# Altium schematic sheet Mechanical.SchDoc: Mechanical
size A4; ApprovedBy: LD Stanton; Author: LD Stanton; CompanyName: University of Cape Town; DrawnBy: Lawrence Stanton; Engineer: Lawrence Stanton; Organization: University of Cape Town; Address1: Department of Electrical Engineering; Address2: Rondebosch; Address3: Cape Town; Address4: South Africa 7701; DocumentNumber: 17; SheetNumber: 17; SheetTotal: 20
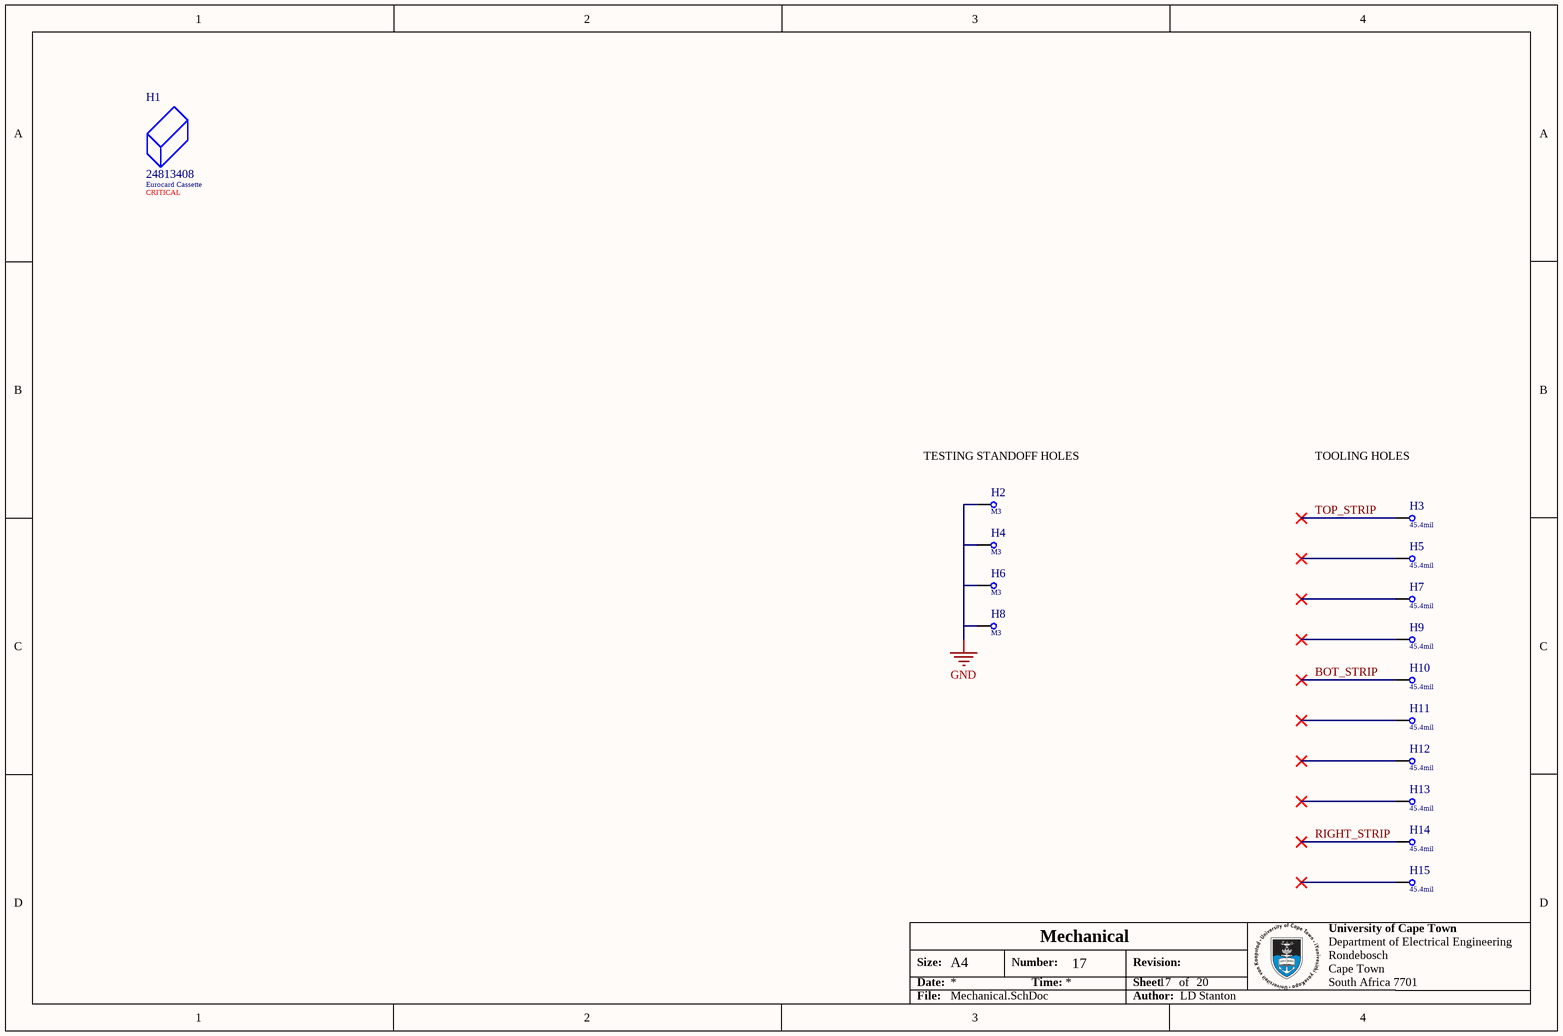
[diagram p0: Mechanical.SchDoc]

## Parts
H1  24813408  Type: Eurocard Cassette  Placement: CRITICAL  (mechanical)
H2  Size: M3  [Mounting Hole M3 Plated Tight Via]  (hidden comment: Mounting Hole M3)  (no BOM)
H3  Size: 45.4mil  [Tooling Hole JLCPCB]  (hidden comment: Tooling Hole JLCPCB)  (no BOM)
H4  Size: M3  [Mounting Hole M3 Plated Tight Via]  (hidden comment: Mounting Hole M3)  (no BOM)
H5  Size: 45.4mil  [Tooling Hole JLCPCB]  (hidden comment: Tooling Hole JLCPCB)  (no BOM)
H6  Size: M3  [Mounting Hole M3 Plated Tight Via]  (hidden comment: Mounting Hole M3)  (no BOM)
H7  Size: 45.4mil  [Tooling Hole JLCPCB]  (hidden comment: Tooling Hole JLCPCB)  (no BOM)
H8  Size: M3  [Mounting Hole M3 Plated Tight Via]  (hidden comment: Mounting Hole M3)  (no BOM)
H9  Size: 45.4mil  [Tooling Hole JLCPCB]  (hidden comment: Tooling Hole JLCPCB)  (no BOM)
H10  Size: 45.4mil  [Tooling Hole JLCPCB]  (hidden comment: Tooling Hole JLCPCB)  (no BOM)
H11  Size: 45.4mil  [Tooling Hole JLCPCB]  (hidden comment: Tooling Hole JLCPCB)  (no BOM)
H12  Size: 45.4mil  [Tooling Hole JLCPCB]  (hidden comment: Tooling Hole JLCPCB)  (no BOM)
H13  Size: 45.4mil  [Tooling Hole JLCPCB]  (hidden comment: Tooling Hole JLCPCB)  (no BOM)
H14  Size: 45.4mil  [Tooling Hole JLCPCB]  (hidden comment: Tooling Hole JLCPCB)  (no BOM)
H15  Size: 45.4mil  [Tooling Hole JLCPCB]  (hidden comment: Tooling Hole JLCPCB)  (no BOM)

## Nets
GND: H2.1 H4.1 H6.1 H8.1
BOT_STRIP: H10.1
RIGHT_STRIP: H14.1
TOP_STRIP: H3.1

Not connected (* = marked no-connect by the designer): H5 1*; H7 1*; H9 1*; H11 1*; H12 1*; H13 1*; H15 1*

## Notes on the sheet
- (near H2) TESTING STANDOFF HOLES
- TOOLING HOLES
- Size:
- Date:
- A4
- Number:
- Time:
- Revision:
- Sheet
- of
- File:
- Author:

## Library data of the parts
H1 = CMP-001-0000-2: Plug-in unit Pro, 3 HE, 8 TE, 24813-408, Schroff; ComponentLink1Description: Catalog; ComponentLink2URL: https://schroff.nvent.com/sites/g/files/hdkjer281/files/acquiadam/2020-11/64812-110.pdf?asset_type=Installation%20Manual%20/%20Instruction%20Sheet; ComponentLink1URL: https://schroff.nvent.com/sites/g/files/hdkjer281/files/acquiadam/2021-10/7_3_Kassetten_e.pdf?asset_type=Catalog; ComponentLink2Description: Manual; Mount: Plug-In
H2 H4 H6 H8 = CMP-00028-00004-3: M3 Mounting Hole
H3 H5 H7 H9-H15 = CMP-00028-00000-8: Tooling Hole Specified by JLCPCB